# EAGLE schematic pocketbone (EAGLE 7.4.0)

## Sheet 1 of 3
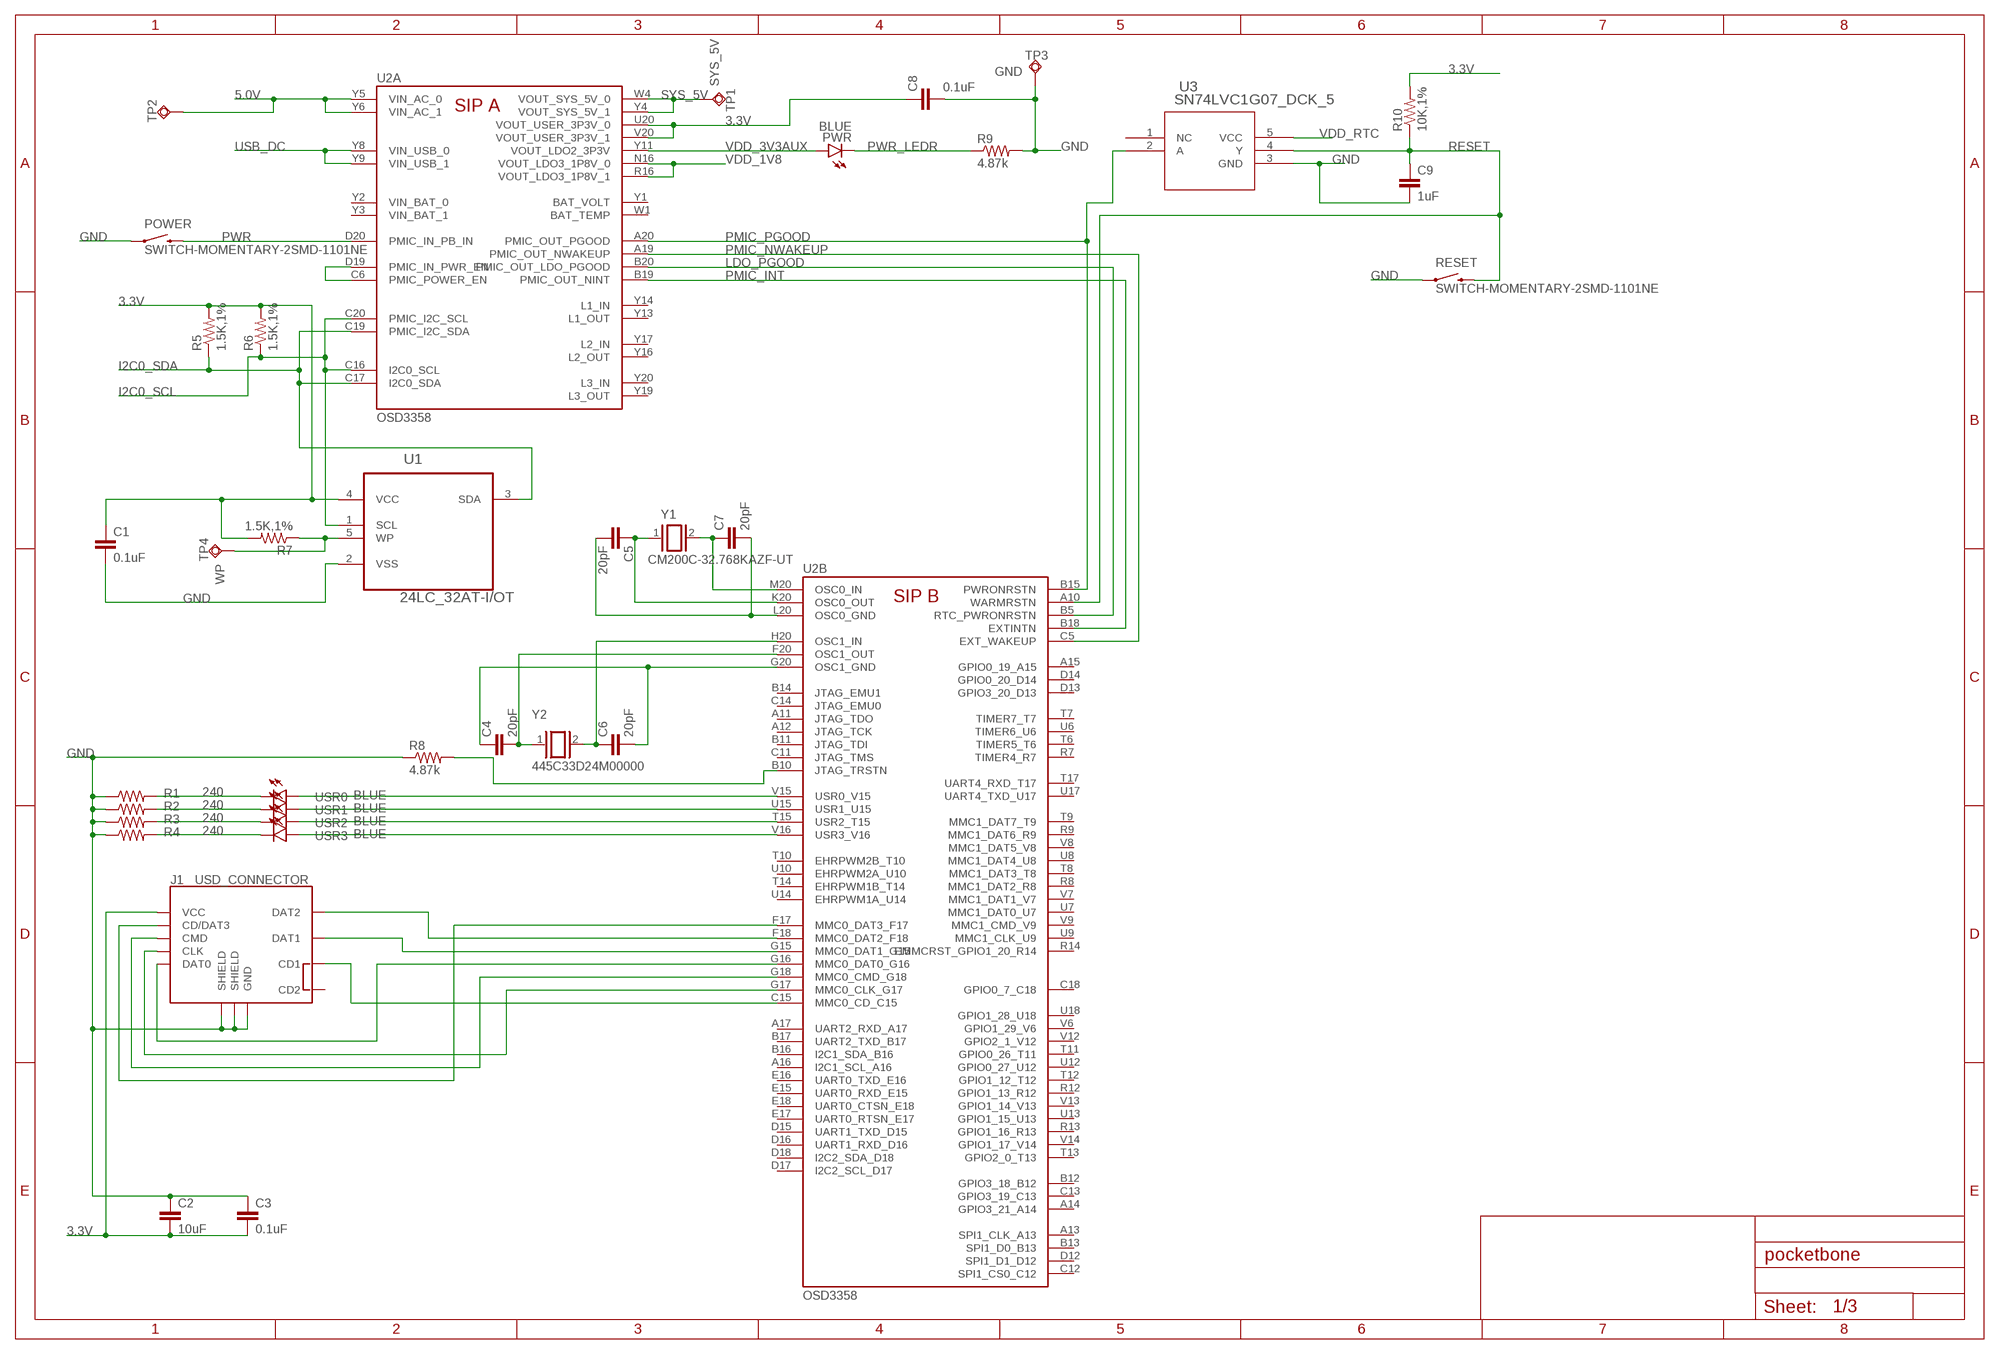
[diagram p0: schematic, sheet 1]

### Parts
C1  0.1uF  CAP0402-CAP  [0402-CAP]
C2  10uF  CAP0805  [0805]
C3  0.1uF  CAP0402-CAP  [0402-CAP]
C4  20pF  CAP0402-CAP  [0402-CAP]
C5  20pF  CAP0402-CAP  [0402-CAP]
C6  20pF  CAP0402-CAP  [0402-CAP]
C7  20pF  CAP0402-CAP  [0402-CAP]
C8  0.1uF  CAP0402-CAP  [0402-CAP]
C9  1uF  CAP0402-CAP  [0402-CAP]
J1  USD_CONNECTOR  [MICRO-SD-SOCKET-PP]
POWER  SWITCH-MOMENTARY-2SMD-1101NE  [TACTILE-SWITCH-1101NE]
PWR  BLUE  LED0603  [LED-0603]
R1  240  RESISTOR0402-RES  [0402-RES]
R2  240  RESISTOR0402-RES  [0402-RES]
R3  240  RESISTOR0402-RES  [0402-RES]
R4  240  RESISTOR0402-RES  [0402-RES]
R5  1.5K,1%  RESISTOR0402-RES  [0402-RES]
R6  1.5K,1%  RESISTOR0402-RES  [0402-RES]
R7  1.5K,1%  RESISTOR0402-RES  [0402-RES]
R8  4.87k  RESISTOR0402-RES  [0402-RES]
R9  4.87k  RESISTOR0402-RES  [0402-RES]
R10  10K,1%  RESISTOR0402-RES  [0402-RES]
RESET  SWITCH-MOMENTARY-2SMD-1101NE  [TACTILE-SWITCH-1101NE]
TP1  TPSQPAD1-17  [P1-17]
TP2  TPSQPAD1-17  [P1-17]
TP3  TPSQPAD1-17  [P1-17]
TP4  TPSQPAD1-17  [P1-17]
U1  24LC_32AT-I/OT  [SOT95P290X145-5N]
U2  OSD3358  [OSD3358]
U3  SN74LVC1G07_DCK_5  [DCK5]
USR0  BLUE  LED0603  [LED-0603]
USR1  BLUE  LED0603  [LED-0603]
USR2  BLUE  LED0603  [LED-0603]
USR3  BLUE  LED0603  [LED-0603]
Y1  CM200C-32.768KAZF-UT  [CM200C-32.768KAZF-UT]
Y2  445C33D24M00000  [445C33D24M00000]

### Nets
3.3V [power]: C1.1 C2.2 C3.2 C8.1 J1.VCC R5.2 R6.2 R7.2 R10.2 U1.4(VCC) U2.U20(A:VOUT_USER_3P3V_0) U2.V20(A:VOUT_USER_3P3V_1) ; also sheet 2
5.0V [power]: TP2.TP U2.Y5(A:VIN_AC_0) U2.Y6(A:VIN_AC_1) ; also sheet 2
GND [ground]: C1.2 C2.1 C3.1 C8.2 C9.2 J1.GND J1.GND1(SHIELD) J1.GND3(SHIELD) POWER.1 R1.1 R2.1 R3.1 R4.1 R8.1 R9.2 RESET.1 TP3.TP U1.2(VSS) U3.3(GND) ; also sheet 2,3
I2C0_SCL: R6.1 U1.1(SCL) U2.C16(A:I2C0_SCL) U2.C20(A:PMIC_I2C_SCL)
I2C0_SDA: R5.1 U1.3(SDA) U2.C17(A:I2C0_SDA) U2.C19(A:PMIC_I2C_SDA)
LDO_PGOOD: U2.B5(B:RTC_PWRONRSTN) U2.B20(A:PMIC_OUT_LDO_PGOOD)
N$2: J1.CLK U2.G17(B:MMC0_CLK_G17)
N$5: J1.CD/DAT3 U2.F17(B:MMC0_DAT3_F17)
N$12: U2.C6(A:PMIC_POWER_EN) U2.D19(A:PMIC_IN_PWR_EN)
N$26: C7.1 U2.M20(B:OSC0_IN) Y1.2
N$27: C5.1 U2.K20(B:OSC0_OUT) Y1.1
N$28: R7.1 TP4.TP U1.5(WP)
N$31: C5.2 C7.2 U2.L20(B:OSC0_GND)
N$32: C6.1 U2.H20(B:OSC1_IN) Y2.2
N$33: C4.2 U2.F20(B:OSC1_OUT) Y2.1
N$34: C4.1 C6.2 U2.G20(B:OSC1_GND)
N$42: R8.2 U2.B10(B:JTAG_TRSTN)
N$43: U2.V16(B:USR3_V16) USR3.A
N$44: U2.T15(B:USR2_T15) USR2.A
N$45: U2.U15(B:USR1_U15) USR1.A
N$46: U2.V15(B:USR0_V15) USR0.A
N$47: R1.2 USR0.C
N$57: R2.2 USR1.C
N$58: R3.2 USR2.C
N$59: R4.2 USR3.C
N$70: J1.DAT1 U2.G15(B:MMC0_DAT1_G15)
N$74: J1.CMD U2.G18(B:MMC0_CMD_G18)
N$75: J1.CD1 U2.C15(B:MMC0_CD_C15)
N$77: J1.DAT0 U2.G16(B:MMC0_DAT0_G16)
NTE: J1.DAT2 U2.F18(B:MMC0_DAT2_F18)
PMIC_INT: U2.B18(B:EXTINTN) U2.B19(A:PMIC_OUT_NINT)
PMIC_NWAKEUP: U2.A19(A:PMIC_OUT_NWAKEUP) U2.C5(B:EXT_WAKEUP)
PMIC_PGOOD: U2.A20(A:PMIC_OUT_PGOOD) U2.B15(B:PWRONRSTN) U3.2(A)
PWR: POWER.2 U2.D20(A:PMIC_IN_PB_IN)
PWR_LEDR: PWR.C R9.1
RESET: C9.1 R10.1 RESET.2 U2.A10(B:WARMRSTN) U3.4(Y)
SYS_5V [power]: TP1.TP U2.W4(A:VOUT_SYS_5V_0) U2.Y4(A:VOUT_SYS_5V_1) ; also sheet 2
USB_DC [power]: U2.Y8(A:VIN_USB_0) U2.Y9(A:VIN_USB_1) ; also sheet 2
VDD_1V8: U2.N16(A:VOUT_LDO3_1P8V_0) U2.R16(A:VOUT_LDO3_1P8V_1) ; also sheet 3
VDD_3V3AUX: PWR.A U2.Y11(A:VOUT_LDO2_3P3V)
VDD_RTC: U3.5(VCC) ; also sheet 3
Unconnected: J1.CD2 U2.A11(B:JTAG_TDO) U2.A12(B:JTAG_TCK) U2.A13(B:SPI1_CLK_A13) U2.A14(B:GPIO3_21_A14) U2.A15(B:GPIO0_19_A15) U2.A16(B:I2C1_SCL_A16) U2.A17(B:UART2_RXD_A17) U2.B1(D:NC4) U2.B2(D:NC5) U2.B3(D:NC6) U2.B11(B:JTAG_TDI) U2.B12(B:GPIO3_18_B12) U2.B13(B:SPI1_D0_B13) U2.B14(B:JTAG_EMU1) U2.B16(B:I2C1_SDA_B16) U2.B17(B:UART2_TXD_B17) U2.C1(D:NC12) U2.C2(D:NC20) U2.C3(D:NC21) U2.C4(D:NC22) U2.C11(B:JTAG_TMS) U2.C12(B:SPI1_CS0_C12) U2.C13(B:GPIO3_19_C13) U2.C14(B:JTAG_EMU0) U2.C18(B:GPIO0_7_C18) U2.D1(D:NC24) U2.D2(D:NC31) U2.D3(D:NC32) U2.D4(D:NC33) U2.D5(D:NC34) U2.D12(B:SPI1_D1_D12) U2.D13(B:GPIO3_20_D13) U2.D14(B:GPIO0_20_D14) U2.D15(B:UART1_TXD_D15) U2.D16(B:UART1_RXD_D16) U2.D17(B:I2C2_SCL_D17) U2.D18(B:I2C2_SDA_D18) U2.E1(D:NC46) U2.E2(D:NC47) U2.E3(D:NC48) U2.E4(D:NC58) U2.E15(B:UART0_RXD_E15) U2.E16(B:UART0_TXD_E16) U2.E17(B:UART0_RTSN_E17) U2.E18(B:UART0_CTSN_E18) U2.F1(D:NC59) U2.F2(D:NC60) U2.F3(D:NC61) U2.F4(D:NC68) U2.G1(D:NC69) U2.G2(D:NC70) U2.G3(D:NC71) U2.G4(D:NC76) U2.H1(D:NC77) U2.H2(D:NC78) U2.H3(D:NC79) U2.H4(D:NC84) U2.J1(D:NC85) U2.J2(D:NC86) U2.J3(D:NC87) U2.J4(D:NC94) U2.K1(D:NC95) U2.K2(D:NC96) U2.K3(D:NC97) U2.K4(D:NC104) U2.L1(D:NC105) U2.L2(D:NC106) U2.L3(D:NC107) U2.L4(D:NC111) U2.M1(D:NC112) U2.M2(D:NC113) U2.M3(D:NC114) U2.M4(D:NC121) U2.N1(D:NC123) U2.N2(D:NC124) U2.N3(D:NC136) U2.N4(D:NC137) U2.P1(D:NC138) U2.P2(D:NC23) U2.P3(D:NC45) U2.P4(D:NC122) U2.R7(B:TIMER4_R7) U2.R8(B:MMC1_DAT2_R8) U2.R9(B:MMC1_DAT6_R9) U2.R12(B:GPIO1_13_R12) U2.R13(B:GPIO1_16_R13) U2.R14(B:EMMCRST_GPIO1_20_R14) U2.T6(B:TIMER5_T6) U2.T7(B:TIMER7_T7) U2.T8(B:MMC1_DAT3_T8) U2.T9(B:MMC1_DAT7_T9) U2.T10(B:EHRPWM2B_T10) U2.T11(B:GPIO0_26_T11) U2.T12(B:GPIO1_12_T12) U2.T13(B:GPIO2_0_T13) U2.T14(B:EHRPWM1B_T14) U2.T17(B:UART4_RXD_T17) U2.U6(B:TIMER6_U6) U2.U7(B:MMC1_DAT0_U7) U2.U8(B:MMC1_DAT4_U8) U2.U9(B:MMC1_CLK_U9) U2.U10(B:EHRPWM2A_U10) U2.U11(D:NC2) U2.U12(B:GPIO0_27_U12) U2.U13(B:GPIO1_15_U13) U2.U14(B:EHRPWM1A_U14) U2.U17(B:UART4_TXD_U17) U2.U18(B:GPIO1_28_U18) U2.V6(B:GPIO1_29_V6) U2.V7(B:MMC1_DAT1_V7) U2.V8(B:MMC1_DAT5_V8) U2.V9(B:MMC1_CMD_V9) U2.V10(D:NC3) U2.V11(D:NC1) U2.V12(B:GPIO2_1_V12) U2.V13(B:GPIO1_14_V13) U2.V14(B:GPIO1_17_V14) U2.W1(A:BAT_TEMP) U2.Y1(A:BAT_VOLT) U2.Y13(A:L1_OUT) U2.Y14(A:L1_IN) U2.Y16(A:L2_OUT) U2.Y17(A:L2_IN) U2.Y19(A:L3_OUT) U2.Y20(A:L3_IN) U3.1(NC)

## Sheet 2 of 3
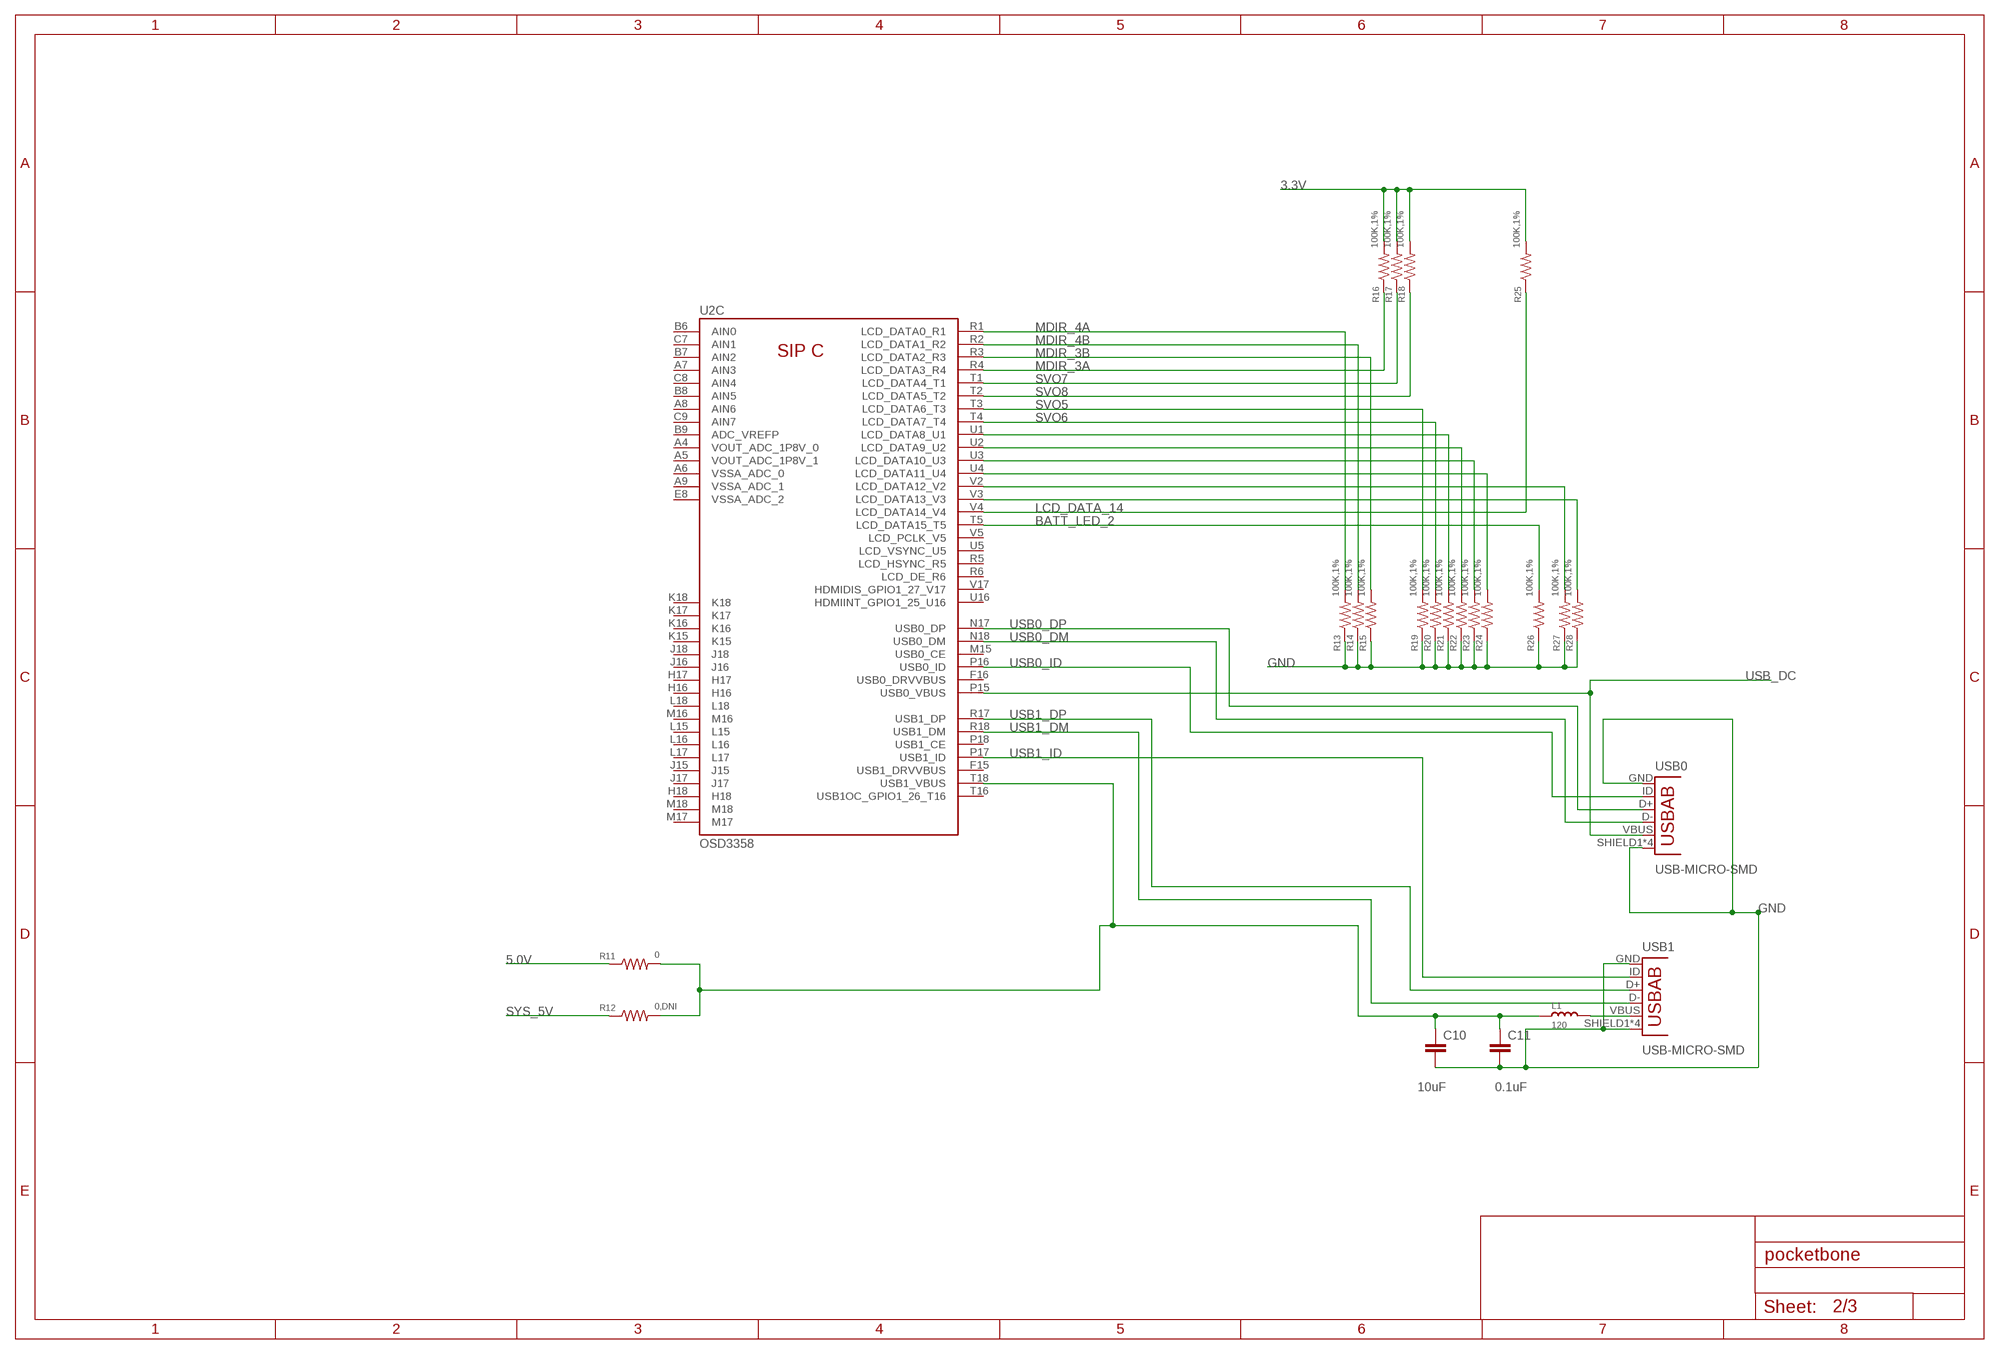
[diagram p1: schematic, sheet 2]

### Parts
C10  10uF  CAP0805  [0805]
C11  0.1uF  CAP0402-CAP  [0402-CAP]
L1  120  INDUCTOR/FERRITE-BEAD'0603'  [L0603]
R11  0  RESISTOR0402-RES  [0402-RES]
R12  0,DNI  RESISTOR0402-RES  [0402-RES]
R13  100K,1%  RESISTOR0402-RES  [0402-RES]
R14  100K,1%  RESISTOR0402-RES  [0402-RES]
R15  100K,1%  RESISTOR0402-RES  [0402-RES]
R16  100K,1%  RESISTOR0402-RES  [0402-RES]
R17  100K,1%  RESISTOR0402-RES  [0402-RES]
R18  100K,1%  RESISTOR0402-RES  [0402-RES]
R19  100K,1%  RESISTOR0402-RES  [0402-RES]
R20  100K,1%  RESISTOR0402-RES  [0402-RES]
R21  100K,1%  RESISTOR0402-RES  [0402-RES]
R22  100K,1%  RESISTOR0402-RES  [0402-RES]
R23  100K,1%  RESISTOR0402-RES  [0402-RES]
R24  100K,1%  RESISTOR0402-RES  [0402-RES]
R25  100K,1%  RESISTOR0402-RES  [0402-RES]
R26  100K,1%  RESISTOR0402-RES  [0402-RES]
R27  100K,1%  RESISTOR0402-RES  [0402-RES]
R28  100K,1%  RESISTOR0402-RES  [0402-RES]
USB0  USB-MICRO-SMD  USB-AB  [USB-AB-MICRO-SMD]
USB1  USB-MICRO-SMD  USB-AB  [USB-AB-MICRO-SMD]

### Nets
3.3V [power]: R16.2 R17.2 R18.2 R25.2 ; also sheet 1
5.0V [power]: R11.1 ; also sheet 1
BATT_LED_2: R26.2 U2.T5(C:LCD_DATA15_T5)
EQEP_1A: R27.2 U2.V2(C:LCD_DATA12_V2)
EQEP_1B: R28.2 U2.V3(C:LCD_DATA13_V3)
GND [ground]: C10.2 C11.2 R13.1 R14.1 R15.1 R19.1 R20.1 R21.1 R22.1 R23.1 R24.1 R26.1 R27.1 R28.1 USB0.GND USB0.SHIELD1(SHIELD) USB0.SHIELD2(SHIELD) USB0.SHIELD3(SHIELD) USB0.SHIELD4(SHIELD) USB1.GND USB1.SHIELD1(SHIELD) USB1.SHIELD2(SHIELD) USB1.SHIELD3(SHIELD) USB1.SHIELD4(SHIELD) ; also sheet 1,3
LCD_DATA_14: R25.1 U2.V4(C:LCD_DATA14_V4)
MDIR_2B: R24.2 U2.U4(C:LCD_DATA11_U4)
MDIR_3A: R16.1 U2.R4(C:LCD_DATA3_R4)
MDIR_3B: R15.2 U2.R3(C:LCD_DATA2_R3)
MDIR_4A: R13.2 U2.R1(C:LCD_DATA0_R1)
MDIR_4B: R14.2 U2.R2(C:LCD_DATA1_R2)
N$1 [power]: L1.2 USB1.VBUS
N$129 [power]: C10.1 C11.1 L1.1 R11.2 R12.2 U2.T18(C:USB1_VBUS)
SERVO_EN: R23.2 U2.U3(C:LCD_DATA10_U3)
SVO5: R19.2 U2.T3(C:LCD_DATA6_T3)
SVO6: R20.2 U2.T4(C:LCD_DATA7_T4)
SVO7: R17.1 U2.T1(C:LCD_DATA4_T1)
SVO8: R18.1 U2.T2(C:LCD_DATA5_T2)
SYS_5V [power]: R12.1 ; also sheet 1
UART5_RX: R22.2 U2.U2(C:LCD_DATA9_U2)
UART5_TX: R21.2 U2.U1(C:LCD_DATA8_U1)
USB0_DM [usb]: U2.N18(C:USB0_DM) USB0.D-
USB0_DP [usb]: U2.N17(C:USB0_DP) USB0.D+
USB0_ID: U2.P16(C:USB0_ID) USB0.ID(USBID)
USB1_DM [usb]: U2.R18(C:USB1_DM) USB1.D-
USB1_DP [usb]: U2.R17(C:USB1_DP) USB1.D+
USB1_ID: U2.P17(C:USB1_ID) USB1.ID(USBID)
USB_DC [power]: U2.P15(C:USB0_VBUS) USB0.VBUS ; also sheet 1
Unconnected: U2.A4(C:VOUT_ADC_1P8V_0) U2.A5(C:VOUT_ADC_1P8V_1) U2.A6(C:VSSA_ADC_0) U2.A7(C:AIN3) U2.A8(C:AIN6) U2.A9(C:VSSA_ADC_1) U2.B6(C:AIN0) U2.B7(C:AIN2) U2.B8(C:AIN5) U2.B9(C:ADC_VREFP) U2.C7(C:AIN1) U2.C8(C:AIN4) U2.C9(C:AIN7) U2.E8(C:VSSA_ADC_2) U2.F15(C:USB1_DRVVBUS) U2.F16(C:USB0_DRVVBUS) U2.H16(C:H16) U2.H17(C:H17) U2.H18(C:H18) U2.J15(C:J15) U2.J16(C:J16) U2.J17(C:J17) U2.J18(C:J18) U2.K15(C:K15) U2.K16(C:K16) U2.K17(C:K17) U2.K18(C:K18) U2.L15(C:L15) U2.L16(C:L16) U2.L17(C:L17) U2.L18(C:L18) U2.M15(C:USB0_CE) U2.M16(C:M16) U2.M17(C:M17) U2.M18(C:M18) U2.P18(C:USB1_CE) U2.R5(C:LCD_HSYNC_R5) U2.R6(C:LCD_DE_R6) U2.T16(C:USB1OC_GPIO1_26_T16) U2.U5(C:LCD_VSYNC_U5) U2.U16(C:HDMIINT_GPIO1_25_U16) U2.V5(C:LCD_PCLK_V5) U2.V17(C:HDMIDIS_GPIO1_27_V17)

## Sheet 3 of 3
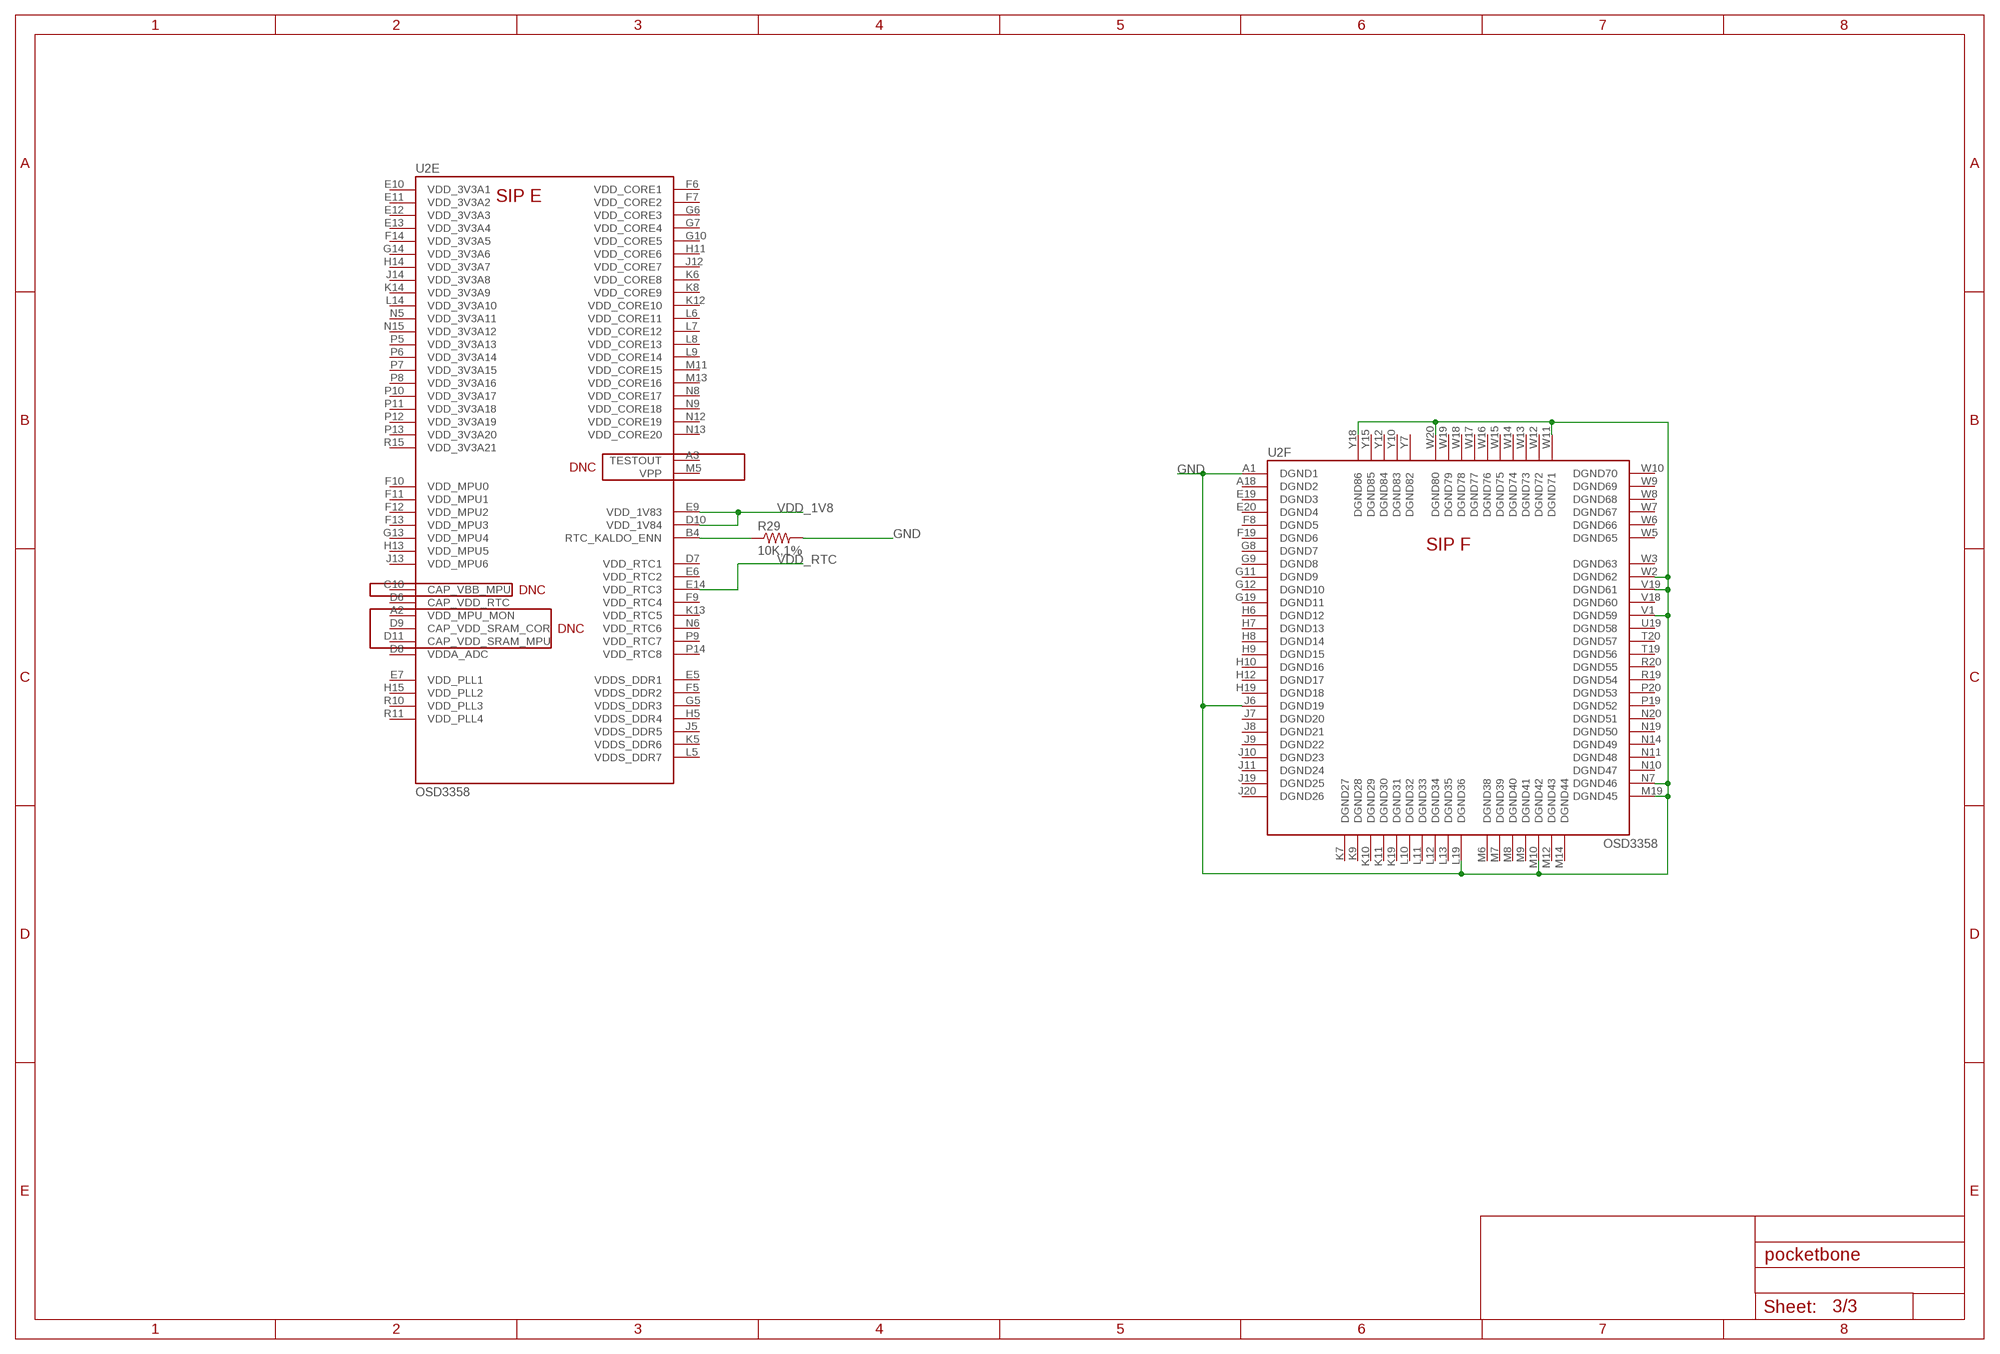
[diagram p2: schematic, sheet 3]

### Parts
R29  10K,1%  RESISTOR0402-RES  [0402-RES]

### Nets
GND [ground]: R29.2 U2.A1(F:DGND1) U2.J6(F:DGND19) U2.L19(F:DGND36) U2.M10(F:DGND42) U2.M19(F:DGND45) U2.N7(F:DGND46) U2.V1(F:DGND59) U2.V19(F:DGND61) U2.W2(F:DGND62) U2.W11(F:DGND71) U2.W20(F:DGND80) U2.Y18(F:DGND86) ; also sheet 1,2
N$131: R29.1 U2.B4(E:RTC_KALDO_ENN)
VDD_1V8: U2.D10(E:VDD_1V84) U2.E9(E:VDD_1V83) ; also sheet 1
VDD_RTC: U2.E14(E:VDD_RTC3) ; also sheet 1
Unconnected: U2.A2(E:VDD_MPU_MON) U2.A3(E:TESTOUT) U2.A18(F:DGND2) U2.C10(E:CAP_VBB_MPU) U2.D6(E:CAP_VDD_RTC) U2.D7(E:VDD_RTC1) U2.D8(E:VDDA_ADC) U2.D9(E:CAP_VDD_SRAM_COR) U2.D11(E:CAP_VDD_SRAM_MPU) U2.E5(E:VDDS_DDR1) U2.E6(E:VDD_RTC2) U2.E7(E:VDD_PLL1) U2.E10(E:VDD_3V3A1) U2.E11(E:VDD_3V3A2) U2.E12(E:VDD_3V3A3) U2.E13(E:VDD_3V3A4) U2.E19(F:DGND3) U2.E20(F:DGND4) U2.F5(E:VDDS_DDR2) U2.F6(E:VDD_CORE1) U2.F7(E:VDD_CORE2) U2.F8(F:DGND5) U2.F9(E:VDD_RTC4) U2.F10(E:VDD_MPU0) U2.F11(E:VDD_MPU1) U2.F12(E:VDD_MPU2) U2.F13(E:VDD_MPU3) U2.F14(E:VDD_3V3A5) U2.F19(F:DGND6) U2.G5(E:VDDS_DDR3) U2.G6(E:VDD_CORE3) U2.G7(E:VDD_CORE4) U2.G8(F:DGND7) U2.G9(F:DGND8) U2.G10(E:VDD_CORE5) U2.G11(F:DGND9) U2.G12(F:DGND10) U2.G13(E:VDD_MPU4) U2.G14(E:VDD_3V3A6) U2.G19(F:DGND11) U2.H5(E:VDDS_DDR4) U2.H6(F:DGND12) U2.H7(F:DGND13) U2.H8(F:DGND14) U2.H9(F:DGND15) U2.H10(F:DGND16) U2.H11(E:VDD_CORE6) U2.H12(F:DGND17) U2.H13(E:VDD_MPU5) U2.H14(E:VDD_3V3A7) U2.H15(E:VDD_PLL2) U2.H19(F:DGND18) U2.J5(E:VDDS_DDR5) U2.J7(F:DGND20) U2.J8(F:DGND21) U2.J9(F:DGND22) U2.J10(F:DGND23) U2.J11(F:DGND24) U2.J12(E:VDD_CORE7) U2.J13(E:VDD_MPU6) U2.J14(E:VDD_3V3A8) U2.J19(F:DGND25) U2.J20(F:DGND26) U2.K5(E:VDDS_DDR6) U2.K6(E:VDD_CORE8) U2.K7(F:DGND27) U2.K8(E:VDD_CORE9) U2.K9(F:DGND28) U2.K10(F:DGND29) U2.K11(F:DGND30) U2.K12(E:VDD_CORE10) U2.K13(E:VDD_RTC5) U2.K14(E:VDD_3V3A9) U2.K19(F:DGND31) U2.L5(E:VDDS_DDR7) U2.L6(E:VDD_CORE11) U2.L7(E:VDD_CORE12) U2.L8(E:VDD_CORE13) U2.L9(E:VDD_CORE14) U2.L10(F:DGND32) U2.L11(F:DGND33) U2.L12(F:DGND34) U2.L13(F:DGND35) U2.L14(E:VDD_3V3A10) U2.M5(E:VPP) U2.M6(F:DGND38) U2.M7(F:DGND39) U2.M8(F:DGND40) U2.M9(F:DGND41) U2.M11(E:VDD_CORE15) U2.M12(F:DGND43) U2.M13(E:VDD_CORE16) U2.M14(F:DGND44) U2.N5(E:VDD_3V3A11) U2.N6(E:VDD_RTC6) U2.N8(E:VDD_CORE17) U2.N9(E:VDD_CORE18) U2.N10(F:DGND47) U2.N11(F:DGND48) U2.N12(E:VDD_CORE19) U2.N13(E:VDD_CORE20) U2.N14(F:DGND49) U2.N15(E:VDD_3V3A12) U2.N19(F:DGND50) U2.N20(F:DGND51) U2.P5(E:VDD_3V3A13) U2.P6(E:VDD_3V3A14) U2.P7(E:VDD_3V3A15) U2.P8(E:VDD_3V3A16) U2.P9(E:VDD_RTC7) U2.P10(E:VDD_3V3A17) U2.P11(E:VDD_3V3A18) U2.P12(E:VDD_3V3A19) U2.P13(E:VDD_3V3A20) U2.P14(E:VDD_RTC8) U2.P19(F:DGND52) U2.P20(F:DGND53) U2.R10(E:VDD_PLL3) U2.R11(E:VDD_PLL4) U2.R15(E:VDD_3V3A21) U2.R19(F:DGND54) U2.R20(F:DGND55) U2.T19(F:DGND56) U2.T20(F:DGND57) U2.U19(F:DGND58) U2.V18(F:DGND60) U2.W3(F:DGND63) U2.W5(F:DGND65) U2.W6(F:DGND66) U2.W7(F:DGND67) U2.W8(F:DGND68) U2.W9(F:DGND69) U2.W10(F:DGND70) U2.W12(F:DGND72) U2.W13(F:DGND73) U2.W14(F:DGND74) U2.W15(F:DGND75) U2.W16(F:DGND76) U2.W17(F:DGND77) U2.W18(F:DGND78) U2.W19(F:DGND79) U2.Y7(F:DGND82) U2.Y10(F:DGND83) U2.Y12(F:DGND84) U2.Y15(F:DGND85)

## Power pins joined to a net without a drawn wire
VIN_BAT_0: U2.Y2(A:VIN_BAT_0)
VIN_BAT_1: U2.Y3(A:VIN_BAT_1)

## Library data of the parts
C1-C11 = Strawson_Eagle_Lib:CAP: Capacitor Standard 0603 ceramic capacitor, and 0.1" leaded capacitor.
J1 = pocketbone:USD_CONNECTOR: microSD Socket Push-push type µSD socket. Footprint production proven. Symbol has new and improved layout and naming accuracy. SparkFun Electronics SKU : PRT-00127. tDoc lines correctly indicate media card edge positions when inserting (unlocked, locked, depressed). NOTE: CD1 and CD2 are connected internally; PROD_ID: CONN-07820
L1 = Seeed-OPL-Inductor:INDUCTOR/FERRITE-BEAD
POWER RESET = SparkFun-Electromechanical:SWITCH-MOMENTARY-2: Various NO switches- pushbuttons, reed, etc; PROD_ID: SWCH-00815
PWR USR0 USR1-USR3 = BeagleBone_Blue:LED: LEDs Standard schematic elements and footprints for 5mm, 3mm, 1206, and 0603 sized LEDs. 5mm - Spark Fun Electronics SKU : COM-00529 (and others)
R1-R29 = Strawson_Eagle_Lib:RESISTOR: Resistor Basic schematic elements and footprints for 0603, 1206, and PTH resistors.
TP1 = pocketbone:TPSQ: Test pad; TP_SIGNAL_NAME: SYS_5V
TP2 = pocketbone:TPSQ: Test pad; TP_SIGNAL_NAME: 5.0V
TP3 = pocketbone:TPSQ: Test pad; TP_SIGNAL_NAME: GND
TP4 = pocketbone:TPSQ: Test pad; TP_SIGNAL_NAME: WP
U1 = pocketbone:24LC_: IC, I2C Serial EEPROM,SOT-23-5; MPN: 24LC32AT-I/OT; OC_FARNELL: 1700993; OC_NEWARK: 08P0113; PACKAGE: SOT-23-5; SUPPLIER: MICROCHIP
U2 = pocketbone:OSD3358: Octavo Systems LLC - OSD3358 Rev A
U3 = pocketbone:SN74LVC1G07_DCK_5; DATASHEETURL: http://www.ti.com/lit/gpn/SN74LVC1G07; DESCRIPTION: Single Buffer/Driver With Open-Drain Output; FAMILY_NAME: LL BUFFER AND DRIVER WITH OPEN-DRAIN OUTPUT; GENERIC_PART_NUMBER: SN74LVC1G07; INDUSTRY_STD_PKG_TYPE: SC70; MANUFACTURER: Texas Instruments; MANUFACTURER_PART_NUMBER: sn74lvc1g07_dck_5; PACKAGE_DESIGNATOR: DCK; PIN_COUNT: 5; VENDOR: Texas Instruments
USB0 USB1 = pocketbone:USB-AB: This is a USB AB connector that is compatible with USB OTG. i.e. this connector can serve as a host or device
Y1 = pocketbone:CM200C-32.768KAZF-UT
Y2 = pocketbone:445C33D24M00000

## Net classes
0 default: width 0.152 mm, drill 0.33 mm, clearance 0.152 mm
1 ground: width 0.33 mm, drill 0.33 mm, clearance 0.152 mm
2 usb: width 0.152 mm, clearance 0.152 mm
3 power: width 0.33 mm, drill 0.33 mm, clearance 0.152 mm